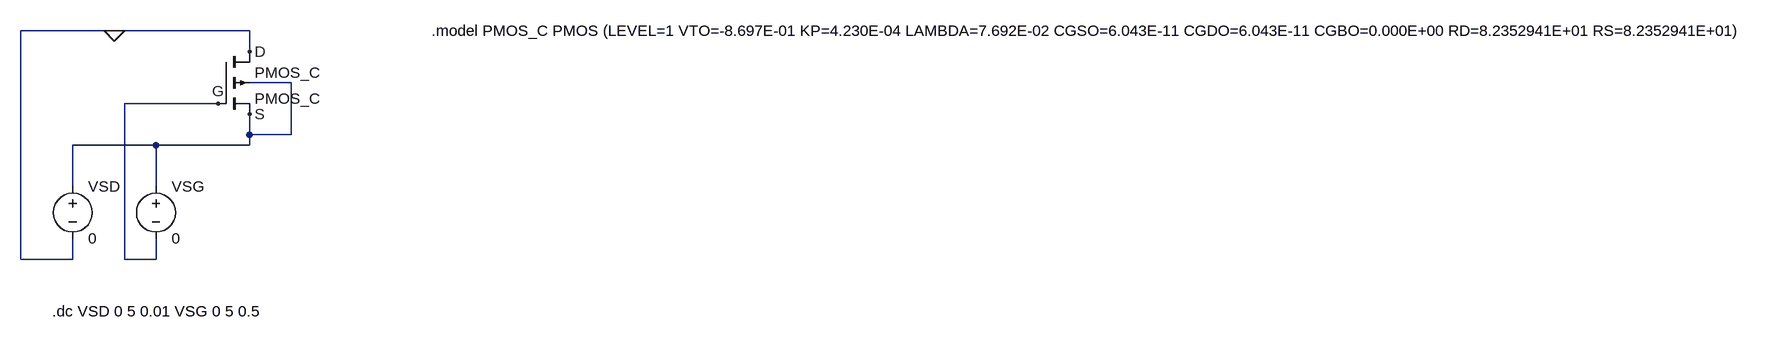
[diagram p0: schematic Validation_PMOS.asc]
Validation_PMOS.asc, the LTspice schematic file:
Version 4.1
SHEET 1 2580 680
WIRE -48 0 -192 0
WIRE 160 0 -48 0
WIRE 160 32 160 0
WIRE 224 80 160 80
WIRE 112 112 -32 112
WIRE 160 160 160 128
WIRE 224 160 224 80
WIRE 224 160 160 160
WIRE 16 176 -112 176
WIRE 160 176 160 160
WIRE 160 176 16 176
WIRE -112 240 -112 176
WIRE 16 240 16 176
WIRE -192 352 -192 0
WIRE -112 352 -112 320
WIRE -112 352 -192 352
WIRE -32 352 -32 112
WIRE 16 352 16 320
WIRE 16 352 -32 352
FLAG 160 32 D
FLAG 112 112 G
FLAG 160 128 S
FLAG -48 0 0
SYMBOL pmos4 112 32 R0
SYMATTR InstName PMOS_C
SYMATTR Value PMOS_C
SYMATTR Value2 l=65n w=200n
SYMBOL voltage -112 224 R0
WINDOW 123 0 0 Left 0
WINDOW 39 0 0 Left 0
SYMATTR InstName VSD
SYMATTR Value 0
SYMBOL voltage 16 224 R0
WINDOW 123 0 0 Left 0
WINDOW 39 0 0 Left 0
SYMATTR InstName VSG
SYMATTR Value 0
TEXT 440 0 Left 2 !.model PMOS_C PMOS (LEVEL=1 VTO=-8.697E-01 KP=4.230E-04 LAMBDA=7.692E-02 CGSO=6.043E-11 CGDO=6.043E-11 CGBO=0.000E+00 RD=8.2352941E+01 RS=8.2352941E+01)
TEXT -144 432 Left 2 !.dc VSD 0 5 0.01 VSG 0 5 0.5

The netlist it stands for:
* Validation_PMOS.asc
M§PMOS_C 0 G S S PMOS_C l=65n w=200n
VSD S 0 0
VSG S G 0
.model NMOS NMOS
.model PMOS PMOS
.lib standard.mos
.model PMOS_C PMOS (LEVEL=1 VTO=-8.697E-01 KP=4.230E-04 LAMBDA=7.692E-02 CGSO=6.043E-11 CGDO=6.043E-11 CGBO=0.000E+00 RD=8.2352941E+01 RS=8.2352941E+01)
.dc VSD 0 5 0.01 VSG 0 5 0.5
.backanno
.end